# Altium schematic sheet Sheet1.SCHDOC: ZX Evoliution
size 558 x 431 mm; Author: NedoPC; CompanyName: NedoPC; Revision: C; SheetNumber: 1; SheetTotal: 2; DocumentName: Sheet1.SCHDOC
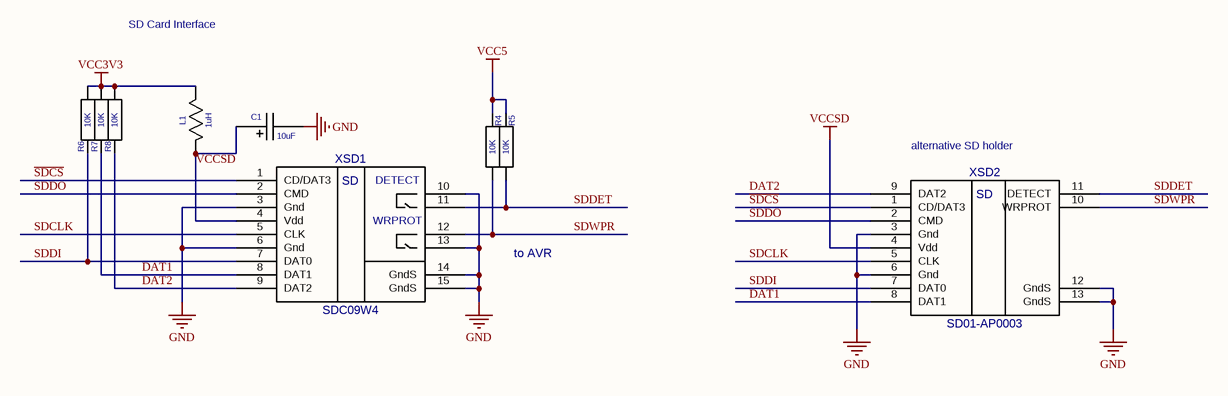
[diagram p0: Sheet1.SCHDOC]

## Parts
C1  value 10uF  [EC-CHIP]  (hidden comment: ECAPCHIP)
L1  value 1uH  [L-CHIP]  (hidden comment: L-CHIP)
R4  value 10K  [R-CHIP]  (hidden comment: RESCHIP)
R5  value 10K  [R-CHIP]  (hidden comment: RESCHIP)
R6  value 10K  [R-CHIP]  (hidden comment: RESCHIP)
R7  value 10K  [R-CHIP]  (hidden comment: RESCHIP)
R8  value 10K  [R-CHIP]  (hidden comment: RESCHIP)
XSD1  SDC09W4  [SDC09W4]
XSD2  SD01-AP0003  [SD01-AP0003]

## Nets
GND: C1.2 XSD1.3(Gnd) XSD1.6(Gnd) XSD1.10(DETECT) XSD1.13(WRPROT) XSD1.14(GndS) XSD1.15(GndS) XSD2.3(Gnd) XSD2.6(Gnd) XSD2.12(GndS) XSD2.13(GndS)
VCC3V3: L1.1 R6.1(i/o) R7.1(i/o) R8.1(i/o)
VCC5: R4.2(i/o1) R5.2(i/o1)
VCCSD: C1.1 L1.2 XSD1.4(Vdd) XSD2.4(Vdd)
DAT1: R7.2(i/o1) XSD1.8(DAT1) XSD2.8(DAT1)
DAT2: R8.2(i/o1) XSD1.9(DAT2) XSD2.9(DAT2)
~{SDCS}: XSD1.1(CD/DAT3) XSD2.1(CD/DAT3)
SDCLK: XSD1.5(CLK) XSD2.5(CLK)
SDDET: R5.1(i/o) XSD1.11(DETECT) XSD2.11(DETECT)
SDDI: R6.2(i/o1) XSD1.7(DAT0) XSD2.7(DAT0)
SDDO: XSD1.2(CMD) XSD2.2(CMD)
SDWPR: R4.1(i/o) XSD1.12(WRPROT) XSD2.10(WRPROT)

Not connected (* = marked no-connect by the designer): XSD2 14 15

## Notes on the sheet
- SD Card Interface
- (near XSD2) alternative SD holder
- to AVR
- A
- B
- C
- D
- E
- F
- 1
- 2
- 3
- 4
- Title
- Size
- A2
- Company
- Rev
- Date
- Filename
- Drawn by
- Sheet
- of
- (in symbol SD01-AP0003) SD
- (in symbol SDC09W4) SD

## Library data of the parts
XSD1 = SDC09W4: Value: *
XSD2 = SD01-AP0003: Value: *